# EAGLE design 5V AC-DC REGULATOR (EAGLE 9.6.2)
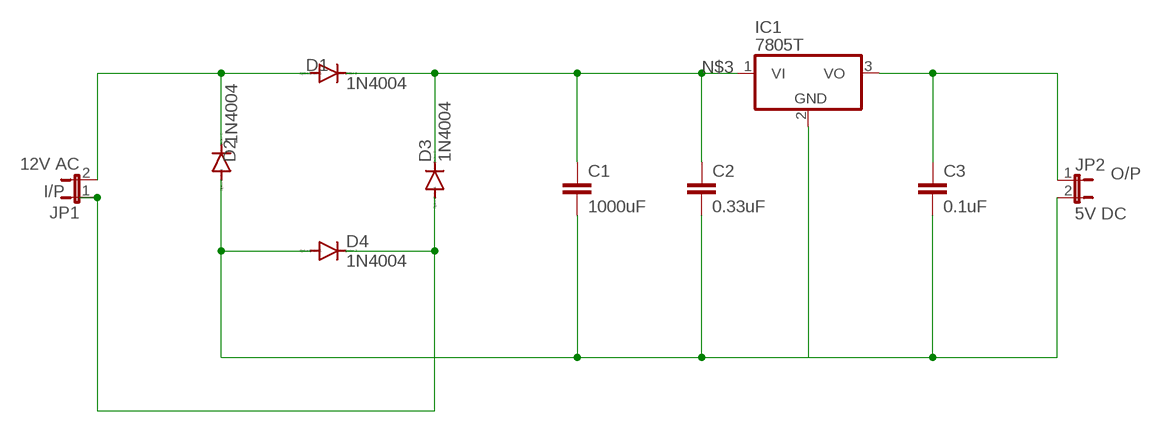
[diagram p0: schematic, sheet 1]

## Parts
C1  1000uF  C2,5-3  [C2.5-3]
C2  0.33uF  C2,5-3  [C2.5-3]
C3  0.1uF  C2,5-3  [C2.5-3]
D1  1N4004  [DO41-10]
D2  1N4004  [DO41-10]
D3  1N4004  [DO41-10]
D4  1N4004  [DO41-10]
IC1  7805T  [TO220H]
JP1  12V AC  JP1E  [JP1]
JP2  5V DC  JP1E  [JP1]

## Nets
I/P: D3.A D4.C JP1.1
N$1: C1.2 C2.2 C3.2 D2.A D4.A IC1.2(GND) JP2.2
N$3: C1.1 C2.1 D1.C D3.C IC1.1(VI)
N$5: D1.A D2.C JP1.2
O/P: C3.1 IC1.3(VO) JP2.1

## Library data of the parts
C1-C3 = capacitor-wima:C: CAPACITOR naming: grid - package width
D1-D4 = diode:1N4004: DIODE general purpose rectifier, 1 A
IC1 = linear:78*: Positive VOLTAGE REGULATOR Source: http://cache.national.com/ds/LM/LM78L05.pdf http://www.fairchildsemi.com/ds/LM/LM7805.pdf
JP1 JP2 = jumper:JP1E: JUMPER

## Board
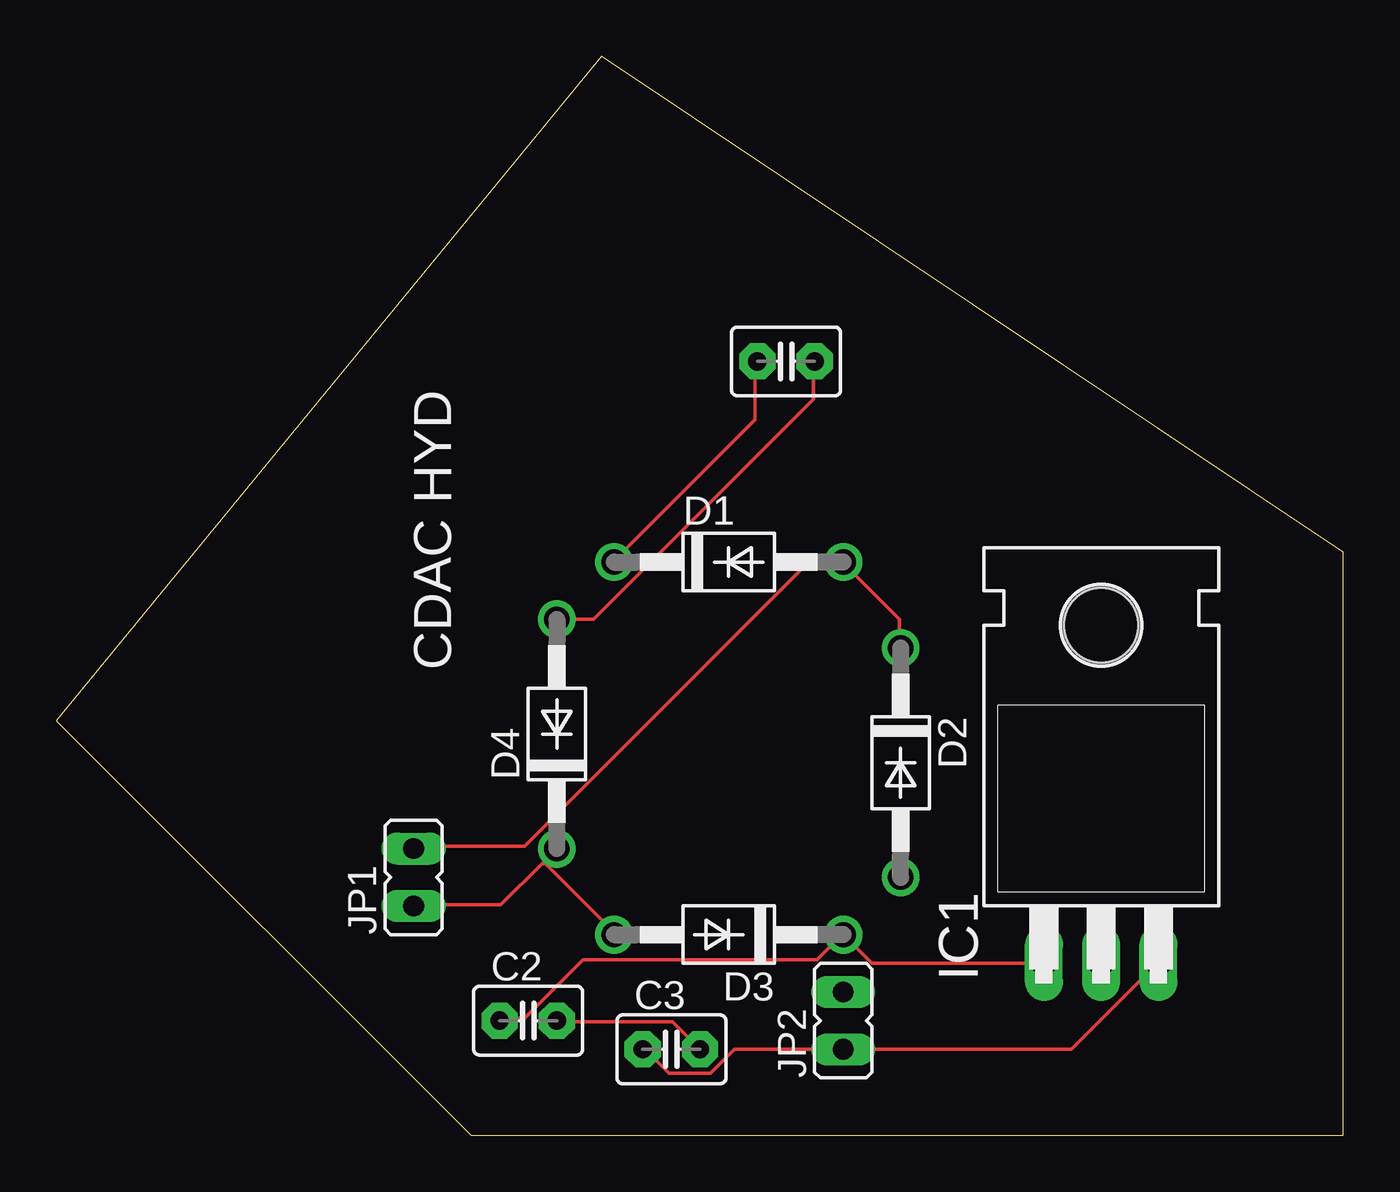
[diagram p1: board, top side]
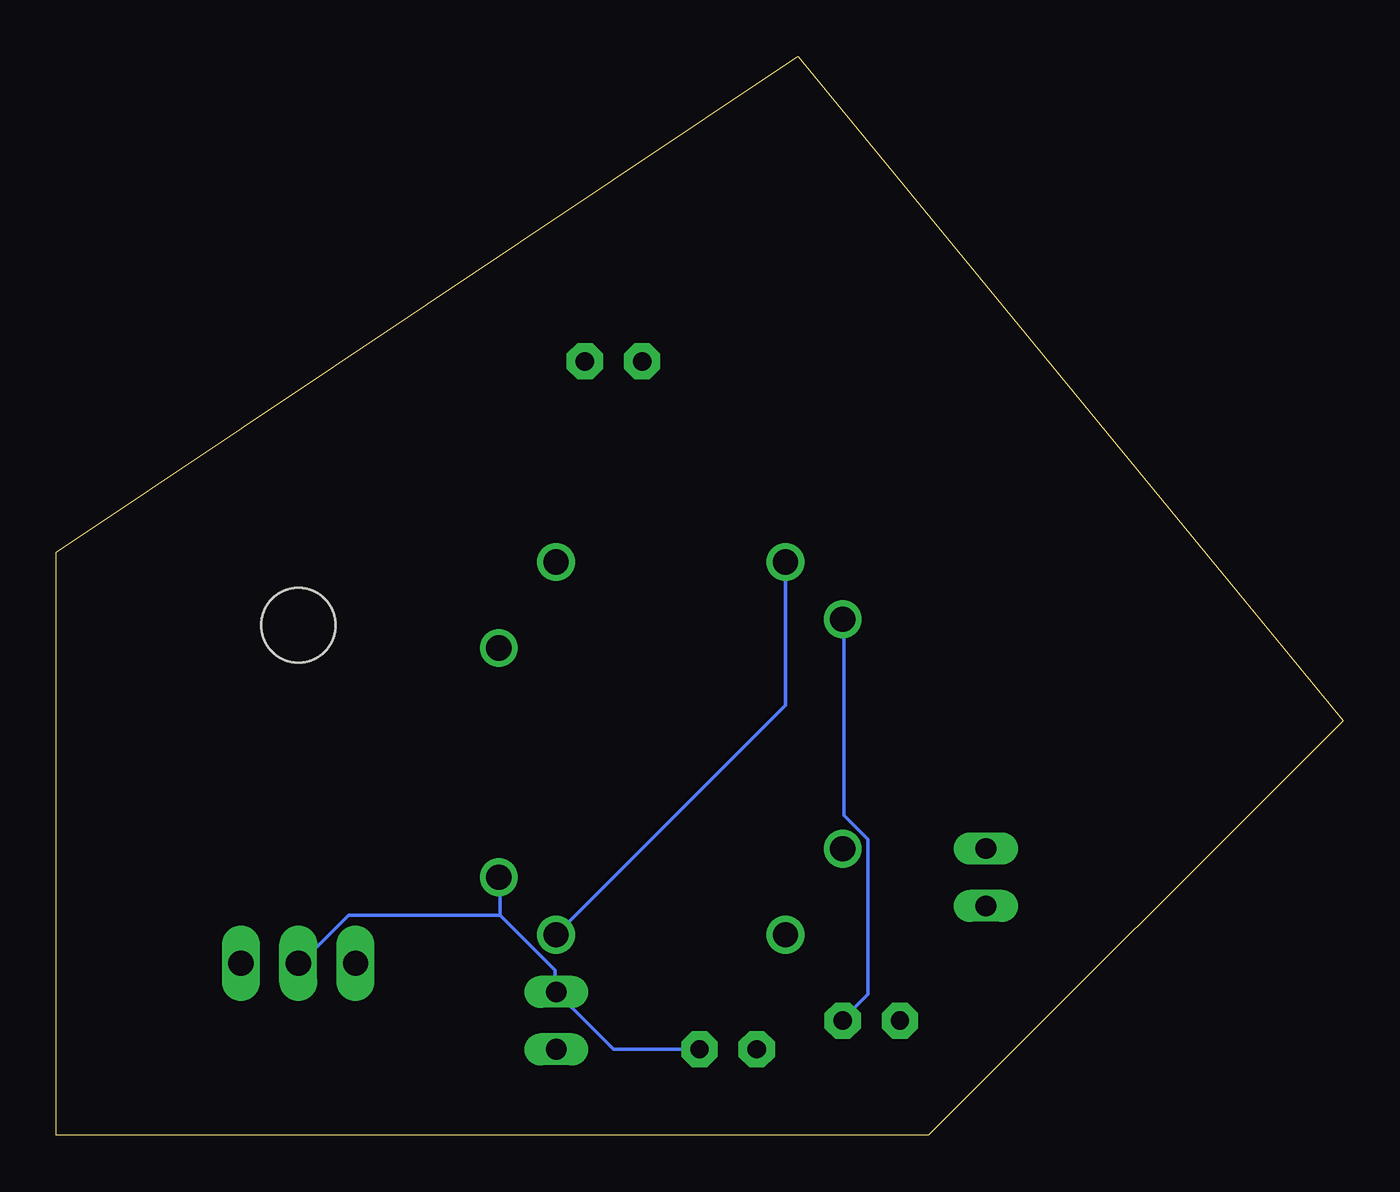
[diagram p2: board, bottom side, seen from below]

Size 57.03 x 47.81 mm. Coordinates in mm from the lower left corner, seen from the top.
Outline: 18.37,0 57.03,0 57.03,25.84 24.16,47.8 0,18.37 18.37,0
Copper layers (1*16): Top 0.035mm / dielectric 1.5mm / Bottom 0.035mm
Design rules "default": minimum track width 6mil, minimum drill 0.35mm, track to track 6mil, track to pad 6mil, pad to pad 6mil, via to via 6mil, smd to smd 6mil, copper to edge 40mil, drill to drill 6mil, minimum pad ring 10mil, minimum via ring 8mil, stop-mask expansion 4mil, vias tented up to drill 0mil, thermal gap 10mil

### Footprints (pad centres in the part's own frame; a part is rotated, then mirrored left to right if it is on the bottom)
C2.5-3 = drill 0.813 pad 1.6 octagon: 1 -1.27,0; 2 1.27,0
DO41-10 = drill 1.118: A 5.08,0; C -5.08,0
TO220H = drill 1.118 long: 1 -2.54,-10.16; 2 0,-10.16; 3 2.54,-10.16 | hole 3.302: 0,4.826
JP1 = drill 0.914 long: 1 0,-1.27; 2 0,1.27

### Placement (x,y rotation side)
C1  32.34,34.29 0 top
C2  20.91,5.08 0 top
C3  27.26,3.81 0 top
D1  29.8,25.4 0 top
D2  37.42,16.51 270 top
D3  29.8,8.89 180 top
D4  22.18,17.78 90 top
IC1  46.31,17.78 0 top
JP1  15.83,11.43 0 top
JP2  34.88,5.08 0 top

### Tracks (layer width: path | path; a pad name or v marks a point on that pad's centre or on a via)
I/P
  Top 0.152: D4.C 21.52,12.04 | 21.52,12.04 19.69,10.21 15.88,10.21 JP1.1 | 21.52,12.04 21.67,12.04 24.72,8.99 D3.A
N$1
  Top 0.152: D4.A 23.81,22.86 33.56,32.61 33.56,34.29 C1.2 | C3.2 27.31,5.03 22.28,5.03 C2.2
  Bottom 0.152: 37.37,9.75 34.93,7.32 34.93,6.4 JP2.2 32.34,3.81 C3.2 | 37.37,9.75 37.37,11.43 D2.A | 37.37,9.75 44.08,9.75 46.21,7.62 IC1.2 | D4.A 22.13,22.86 22.13,14.17 21.06,13.11 21.06,6.25 22.13,5.18 C2.2
N$3
  Top 0.152: C1.1 30.97,34.29 30.97,31.7 24.72,25.45 D1.C | C2.1 19.69,5.18 20.76,5.18 23.35,7.77 33.71,7.77 34.78,8.84 D3.C 36.15,7.62 IC1.1
  Bottom 0.152: D1.C 24.72,19.05 D3.C
N$5
  Top 0.152: JP1.2 15.88,12.8 20.76,12.8 33.26,25.3 34.78,25.3 D1.A 34.93,25.3 37.37,22.86 37.37,21.64 D2.C
O/P
  Top 0.152: C3.1 26.09,3.81 27.16,2.74 28.99,2.74 30.06,3.81 JP2.1 44.99,3.81 48.8,7.62 IC1.3

### Text on the board
tPlace: CDAC HYD